# Altium schematic sheet etna-sch-connectors.SchDoc
size A4; SheetNumber: 1; SheetTotal: 6; PageSetup: Record=PageOptions|CenterHorizontal=True|CenterVertical=True|PrintScale=0.73|XCorrection=1.00|YCorrection=1.00|PrintKind=1|BorderSize=5000000|LeftOffset=0|BottomOffset=0|Orientation=2|PaperLength=1000|PaperWidth=1000|Scale=100|PaperSource=15|PrintQuality=1200|MediaType=1|DitherType=10|PaperKind=A4|PrintScaleMode=1
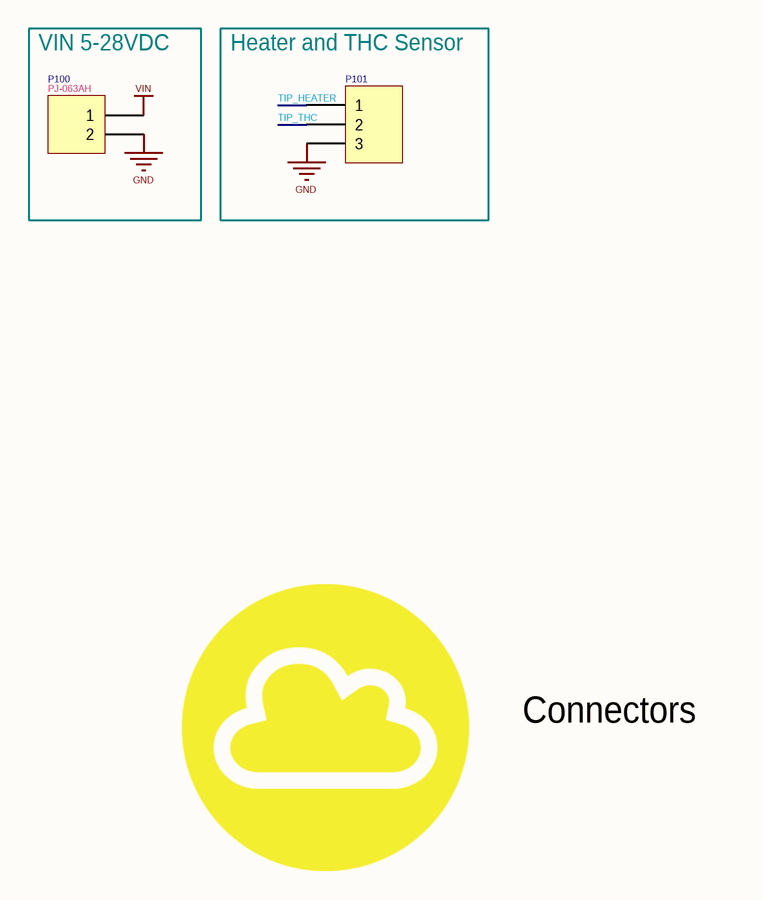
[diagram p0: etna-sch-connectors.SchDoc]

## Parts
P100  PJ-063AH  [PJ-063AH]
P101  (no value)  [3x3x3]

## Blocks framed on the sheet
VIN 5-28VDC: P100
Heater and THC Sensor: P101

## Nets
GND: P100.2 P101.3
VIN: P100.1
TIP_HEATER: P101.1
TIP_THC: P101.2

## Notes on the sheet
- Connectors

## Library data of the parts
P100 = Header 2: Header, 2-Pin; LatestRevisionDate: 17-Jul-2002; LatestRevisionNote: Re-released for DXP Platform.; Publisher: Altium Limited
P101 = Header 3: Header, 3-Pin; LatestRevisionDate: 17-Jul-2002; LatestRevisionNote: Re-released for DXP Platform.; Publisher: Altium Limited